# EAGLE design controller (EAGLE 8.1.0)
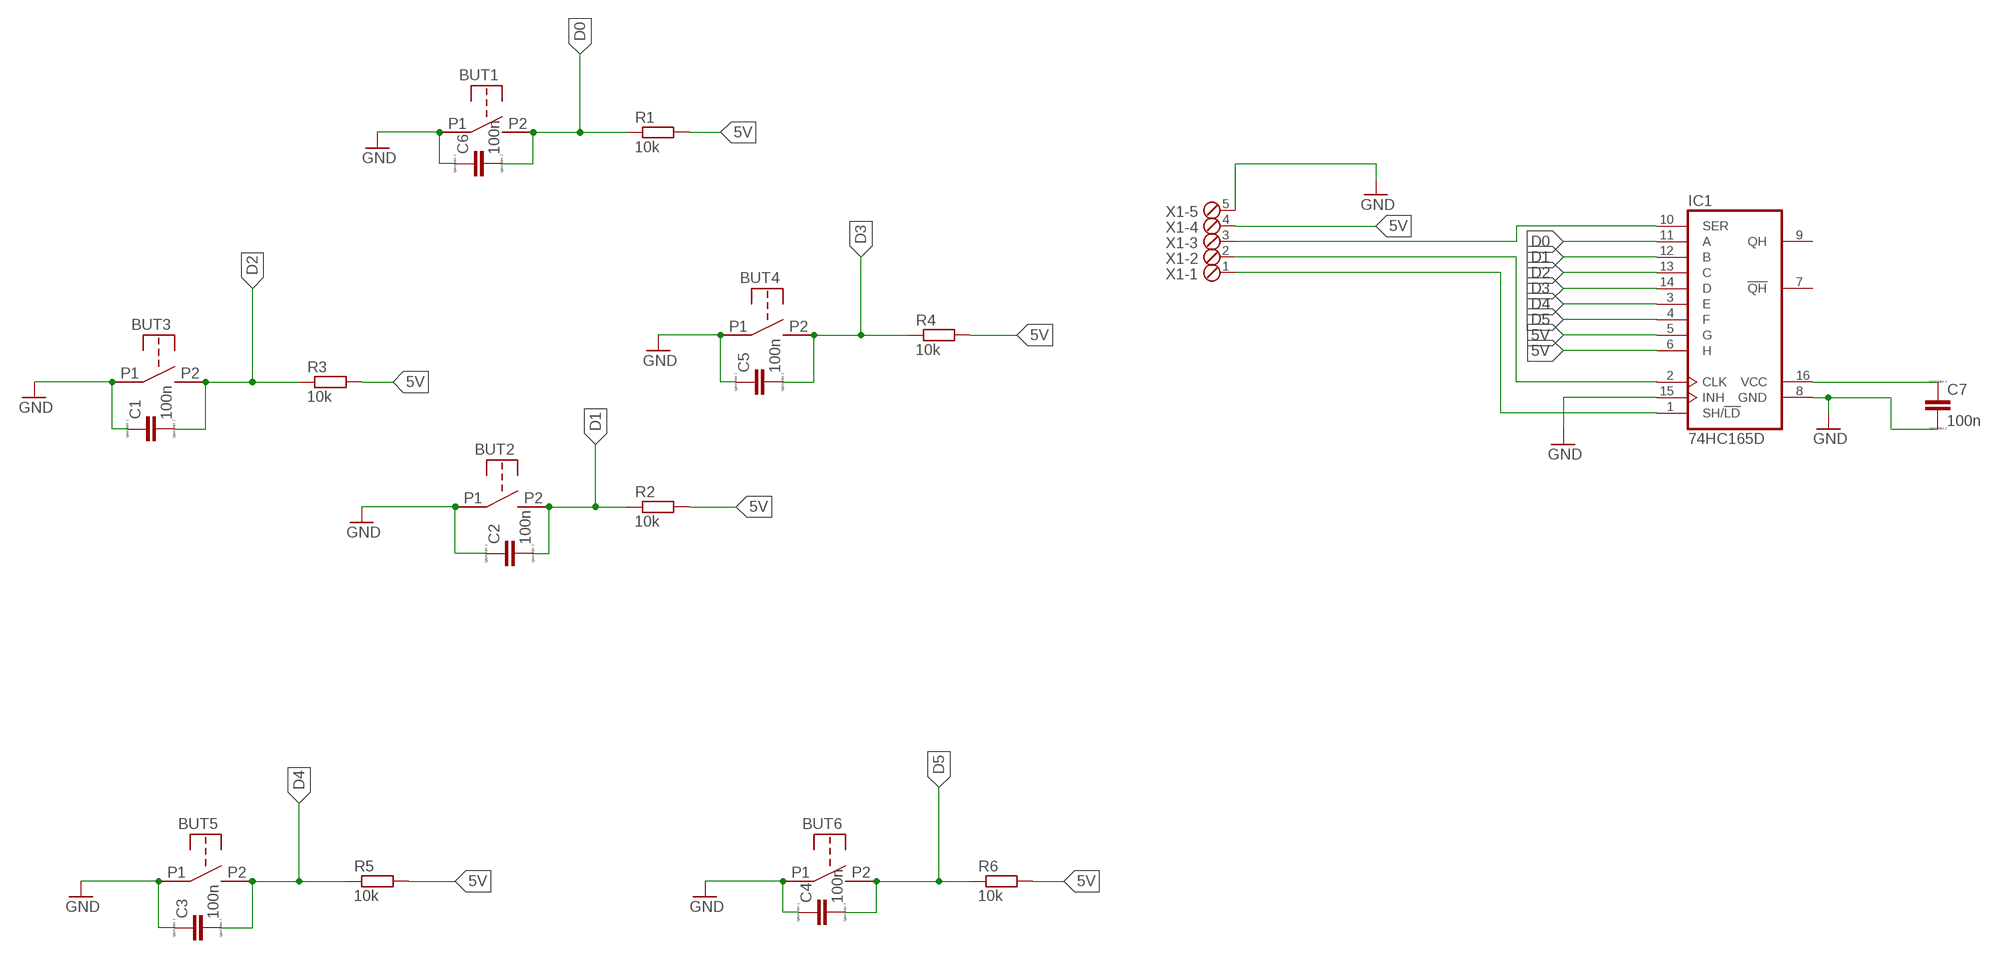
[diagram p0: schematic, sheet 1]

## Parts
BUT1  BUTTON_DEV  [BUTTON_PACK]
BUT2  BUTTON_DEV  [BUTTON_PACK]
BUT3  BUTTON_DEV  [BUTTON_PACK]
BUT4  BUTTON_DEV  [BUTTON_PACK]
BUT5  BUTTON_DEV  [BUTTON_PACK]
BUT6  BUTTON_DEV  [BUTTON_PACK]
C1  100n  C  [C0805]
C2  100n  C  [C0805]
C3  100n  C  [C0805]
C4  100n  C  [C0805]
C5  100n  C  [C0805]
C6  100n  C  [C0805]
C7  100n  C  [C0805]
IC1  74HC165D  [SO16]
R1  10k  R-EU_M3516  [M3516]
R2  10k  R-EU_M3516  [M3516]
R3  10k  R-EU_M3516  [M3516]
R4  10k  R-EU_M3516  [M3516]
R5  10k  R-EU_M3516  [M3516]
R6  10k  R-EU_M3516  [M3516]
X1  MPT5  [5POL254]

## Nets
5V: C7.1 IC1.5(G) IC1.6(H) IC1.16(VCC) R1.2 R2.2 R3.2 R4.2 R5.2 R6.2 X1.4
D0: BUT1.P2 BUT1.P2'(P2) C6.2 IC1.11(A) R1.1
D1: BUT2.P2 BUT2.P2'(P2) C2.2 IC1.12(B) R2.1
D2: BUT3.P2 BUT3.P2'(P2) C1.2 IC1.13(C) R3.1
D3: BUT4.P2 BUT4.P2'(P2) C5.2 IC1.14(D) R4.1
D4: BUT5.P2 BUT5.P2'(P2) C3.2 IC1.3(E) R5.1
D5: BUT6.P2 BUT6.P2'(P2) C4.2 IC1.4(F) R6.1
GND: BUT1.P1 BUT1.P1'(P1) BUT2.P1 BUT2.P1'(P1) BUT3.P1 BUT3.P1'(P1) BUT5.P1 BUT5.P1'(P1) BUT6.P1 BUT6.P1'(P1) C1.1 C2.1 C3.1 C4.1 C6.1 C7.2 IC1.8(GND) IC1.15(INH) X1.5
N3: BUT4.P1 BUT4.P1'(P1) C5.1 ; supply symbol labelled GND
N$1: IC1.1(SH/!LD) X1.1
N$2: IC1.2(CLK) X1.2
N$3: IC1.10(SER) X1.3
Unconnected: IC1.7(!QH) IC1.9(QH)

## Library data of the parts
BUT1-BUT6 = button:BUTTON_DEV
C1-C7 = eagle-ltspice:C: CAPACITOR, European symbol; SPICEMODEL: NONE; SPICEPREFIX: C
IC1 = 74xx-eu:74*165: 8-bit parallel load SHIFT REGISTER
R1-R6 = resistor:R-EU_: RESISTOR, European symbol
X1 = con-phoenix-254:MPT5: PHOENIX CONNECTOR; OC_FARNELL: unknown; OC_NEWARK: unknown

## Board
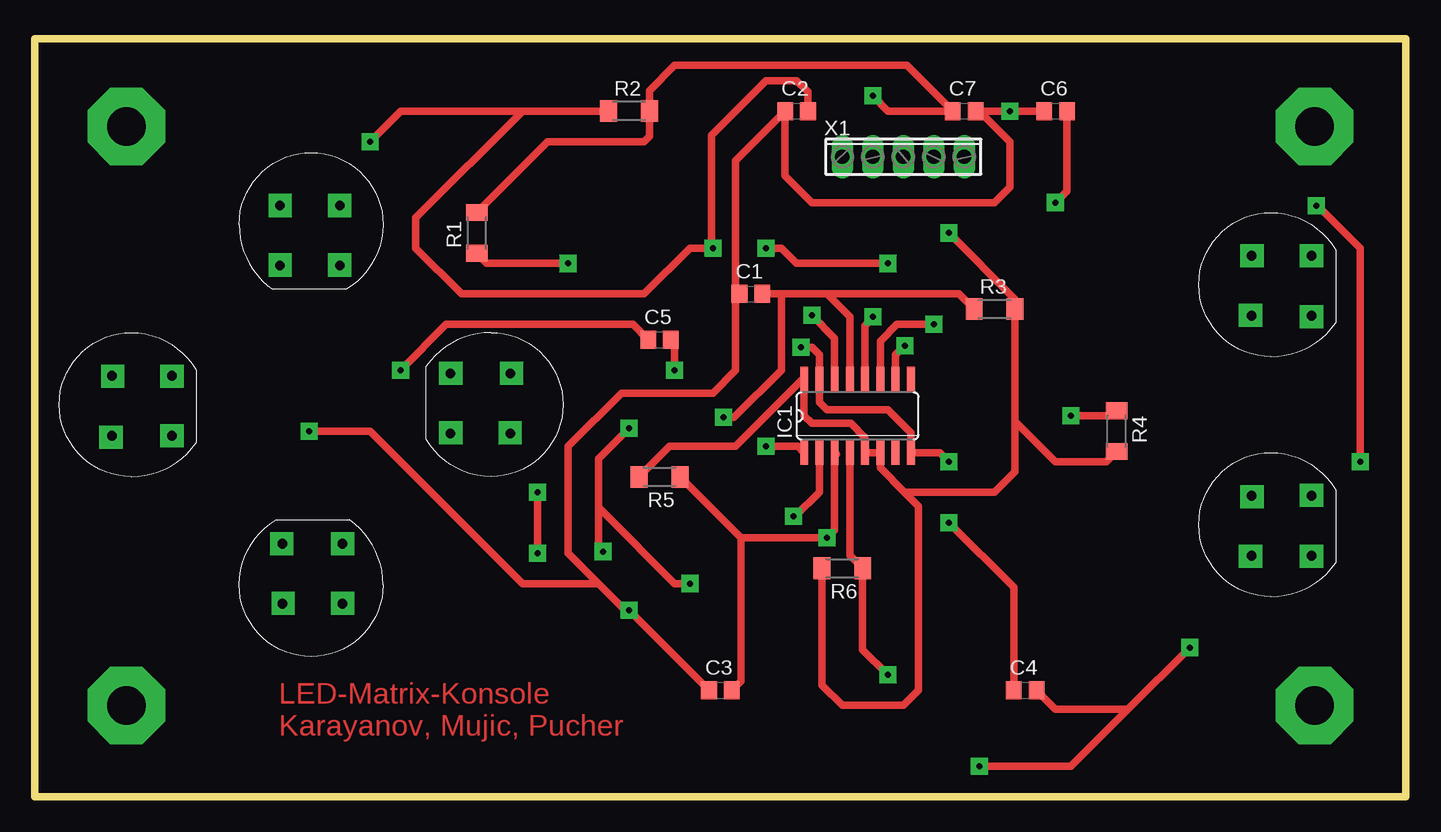
[diagram p1: board, top side]
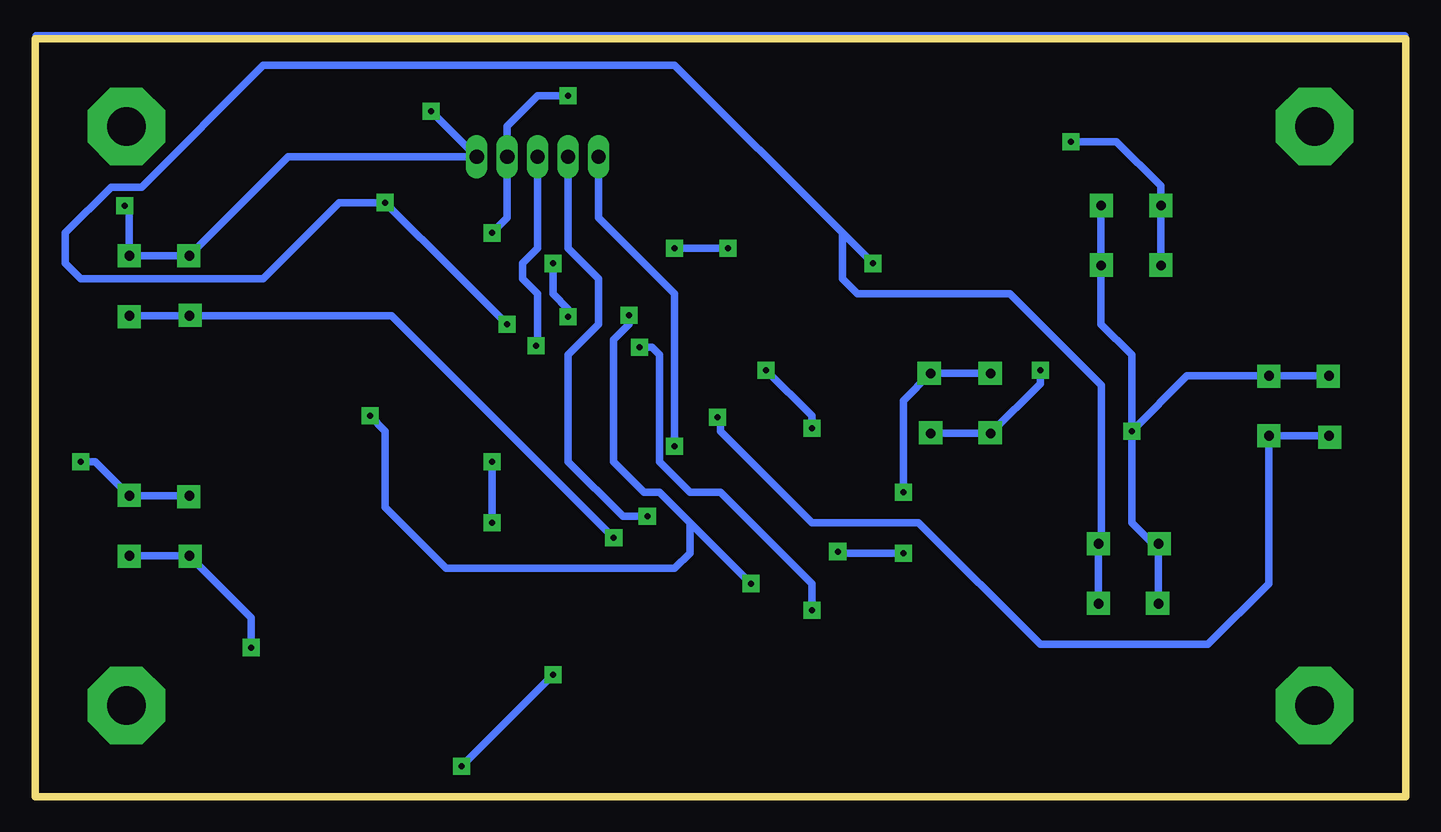
[diagram p2: board, bottom side, seen from below]

Size 114.28 x 63.17 mm. Coordinates in mm from the lower left corner, seen from the top.
Outline: 0,0 114.28,0 114.28,63.17 0,63.17 0,0
Copper layers (1*16): Top 0.035mm / dielectric 1.5mm / Bottom 0.035mm
Design rules "default": minimum track width 10mil, minimum drill 24mil, track to track 8mil, track to pad 8mil, pad to pad 8mil, via to via 8mil, smd to smd 8mil, copper to edge 40mil, drill to drill 8mil, minimum pad ring 10mil, minimum via ring 8mil, stop-mask expansion 4mil, vias tented up to drill 0mil, thermal gap 10mil

### Footprints (pad centres in the part's own frame; a part is rotated, then mirrored left to right if it is on the bottom)
BUTTON_PACK = drill 0.8 square: P1 -1.6,2.4; P1' 3.4,2.4; P2 -1.6,-2.6; P2' 3.4,-2.6
C0805 = smd 1.3 x 1.5: 1 -0.95,0; 2 0.95,0
SO16 = smd 0.66 x 2.032: 1 -4.445,-3.073; 2 -3.175,-3.073; 3 -1.905,-3.073; 4 -0.635,-3.073; 5 0.635,-3.073; 6 1.905,-3.073; 7 3.175,-3.073; 8 4.445,-3.073; 9 4.445,3.073; 10 3.175,3.073; 11 1.905,3.073; 12 0.635,3.073; 13 -0.635,3.073; 14 -1.905,3.073; 15 -3.175,3.073; 16 -4.445,3.073
M3516 = smd 1.4 x 1.8: 1 -1.7,0; 2 1.7,0
5POL254 = drill 1.2 long: 1 -5.08,0; 2 -2.54,0; 3 0,0; 4 2.54,0; 5 5.08,0

### Placement (x,y rotation side)
BUT1  23.03,17.69 90 top
BUT2  23.03,47.69 270 top
BUT3  8.03,32.69 0 top
BUT4  38.03,32.69 180 top
BUT5  103.03,42.69 0 top
BUT6  103.03,22.69 0 top
C1  59.69,41.91 0 top
C2  63.5,57.15 0 top
C3  57.15,8.89 0 top
C4  82.55,8.89 0 top
C5  52.07,38.1 0 top
C6  85.09,57.15 0 top
C7  77.47,57.15 0 top
IC1  68.58,31.75 0 top
R1  36.83,46.99 90 top
R2  49.53,57.15 0 top
R3  80.01,40.64 0 top
R4  90.17,30.48 270 top
R5  52.07,26.67 180 top
R6  67.31,19.05 180 top
X1  72.39,53.34 0 top

### Tracks (layer width: path | path; a pad name or v marks a point on that pad's centre or on a via)
5V  (via drill 0.5 pad 1.42)
  Top 0.61: v69.85,58.42 71.12,57.15 C7.1 72.71,60.96 53.34,60.96 51.23,58.85 R2.2 51.23,55.04 50.8,54.61 42.75,54.61 R1.2 | 81.71,31.32 R3.2 81.71,41.48 v76.2,46.99 | 81.71,31.32 85.09,27.94 89.33,27.94 R4.2 | 81.71,31.32 81.71,27.1 80.01,25.4 72.49,25.4 | IC1.6 70.48,28.57 | R5.2 52.91,29.21 58.42,29.21 64.03,34.82 IC1.16 64.14,31.75 64.77,31.11 68.05,31.11 69.22,29.95 IC1.5 IC1.6 | R6.2 65.61,9.32 67.31,7.62 72.39,7.62 73.66,8.89 73.66,24.23 72.49,25.4 | 72.49,25.4 70.48,27.41 IC1.6
  Bottom 0.61: v69.85,58.42 72.39,58.42 74.93,55.88 X1.4 74.93,48.26 v76.2,46.99
D0  (via drill 0.5 pad 1.42)
  Top 0.61: v74.93,39.37 71.88,39.37 70.48,37.97 IC1.11 | v44.45,44.45 37.67,44.45 R1.1 | v85.09,49.53 86.04,50.48 C6.2
  Bottom 0.61: v74.93,39.37 79.1,43.54 79.12,43.54 85.09,49.51 | 85.09,49.51 88.92,49.51 95.25,43.18 110.49,43.18 111.76,44.45 111.76,46.99 107.95,50.8 105.41,50.8 95.25,60.96 60.96,60.96 46.99,46.99 | v44.45,44.45 46.99,46.99 | BUT1.P2 BUT1.P2' 25.4,21.32 25.4,34.29 33.02,41.91 45.72,41.91 46.99,43.18 46.99,46.99 | v85.09,49.53 85.09,49.51
D1  (via drill 0.5 pad 1.42)
  Top 0.61: 40.64,57.15 R2.1 | v71.12,44.45 63.5,44.45 62.23,45.72 v60.96,45.72 | C2.2 64.45,58.74 63.5,59.69 60.96,59.69 56.39,55.12 56.39,45.85 v56.52,45.72 54.61,45.72 50.8,41.91 35.56,41.91 31.75,45.72 31.75,48.26 40.64,57.15 | v69.85,40.01 69.85,39.88 69.22,39.24 IC1.12 | v27.94,54.61 30.48,57.15 40.64,57.15
  Bottom 0.61: BUT2.P2' BUT2.P2 20.43,50.91 24.13,54.61 v27.94,54.61 | v60.96,45.72 v56.52,45.72 | v71.12,44.45 71.12,41.91 69.85,40.64 v69.85,40.01
D2  (via drill 0.5 pad 1.42)
  Top 0.61: 62.23,41.91 66.04,41.91 | 62.23,41.91 C1.2 | 62.23,41.91 62.23,35.56 58.29,31.62 v57.4,31.62 | IC1.13 67.94,40.01 66.04,41.91 | R3.1 77.04,41.91 66.04,41.91
  Bottom 0.61: BUT3.P2 BUT3.P2' 11.43,17.78 16.51,12.7 30.48,12.7 40.64,22.86 49.53,22.86 57.15,30.48 57.15,31.37 v57.4,31.62
D3  (via drill 0.5 pad 1.42)
  Top 0.61: IC1.14 66.67,38.23 v64.77,40.13 | v54.61,17.78 53.34,17.78 47.37,23.75 46.99,24.13 | v53.34,35.56 53.34,37.78 C5.2 | v86.36,31.75 89.74,31.75 R4.1 | v41.91,20.32 v41.91,25.4 | 46.99,24.13 46.99,28.19 v49.53,30.73 | v47.37,20.45 46.99,20.83 46.99,24.13
  Bottom 0.61: BUT4.P2' BUT4.P2 41.91,33.01 v41.91,25.4 | 59.69,22.86 v54.61,17.78 | v86.36,31.75 85.09,30.48 85.09,24.13 80.01,19.05 60.96,19.05 59.69,20.32 59.69,22.86 | 59.69,22.86 62.23,25.4 63.5,25.4 66.04,27.94 66.04,38.1 64.77,39.37 v64.77,40.13 | v49.53,30.73 49.53,31.75 v53.34,35.56 | v41.91,20.32 47.24,20.32 v47.37,20.45
D4  (via drill 0.5 pad 1.42)
  Top 0.61: 66.8,28.55 IC1.3 66.67,22.23 v66.04,21.59 58.85,21.59 | 58.85,21.59 R5.1 | C3.2 58.85,9.64 58.85,20.32 | 58.85,20.32 58.85,20.75 | 58.85,20.32 58.85,21.59
  Bottom 0.61: BUT5.P2' BUT5.P2 84.54,40.09 v66.04,21.59
D5  (via drill 0.5 pad 1.42)
  Top 0.61: v71.12,10.16 69.01,12.27 R6.1 67.94,20.11 IC1.4 | C4.2 85.09,7.3 91.12,7.3 | 91.12,7.3 v96.27,12.45 | 91.12,7.3 86.36,2.54 v78.74,2.54
  Bottom 0.61: BUT6.P2' BUT6.P2 96.27,14.93 v96.27,12.45 | v71.12,10.16 v78.74,2.54
GND  (via drill 0.5 pad 1.42)
  Top 0.61: 78.74,57.15 C7.2 | v81.28,57.15 78.74,57.15 | v81.28,57.15 C6.1 | v110.49,27.94 110.49,45.72 106.93,49.28 v106.81,49.28 | v22.86,30.48 27.94,30.48 40.64,17.78 46.99,17.78 | C4.1 81.6,17.46 v76.2,22.86 | C3.1 v49.53,15.56 49.21,15.56 46.99,17.78 | 78.74,57.47 C7.2 | 78.74,57.15 81.28,54.61 81.28,50.8 80.01,49.53 64.77,49.53 62.55,51.75 C2.1 58.42,53.02 58.42,42.23 C1.1 58.42,41.59 58.42,35.56 56.52,33.66 48.9,33.66 44.45,29.21 44.45,20.32 46.99,17.78 | v63.88,37.47 64.77,37.47 65.41,36.83 IC1.15 65.41,32.89 66.04,32.26 71.12,32.26 73.03,30.35 IC1.8 75.46,28.68 v76.2,27.94 | C7.2 v81.28,57.15
  Bottom 0.61: BUT5.P1' BUT5.P1 93.18,53.34 X1.5 v81.28,57.15 | BUT2.P1 BUT2.P1' 25.43,39.4 22.86,36.83 v22.86,30.48 | v110.49,27.94 109.28,27.94 BUT6.P1' BUT6.P1 | BUT1.P1 BUT1.P1' 21.09,21.09 22.86,22.86 v22.86,30.48 | BUT3.P1 BUT3.P1' 18.25,35.09 v22.86,30.48 | v76.2,27.94 v76.2,22.86 | v49.53,15.56 49.53,17.78 57.15,25.4 59.69,25.4 62.23,27.94 62.23,36.83 62.87,37.47 v63.88,37.47 | BUT5.P1' | BUT5.P1' 106.43,48.9 v106.81,49.28
N3  (via drill 0.5 pad 1.42)
  Top 0.61: C5.1 49.85,39.37 34.29,39.37 v30.48,35.56
  Bottom 0.61: BUT4.P1 BUT4.P1' 30.48,34.44 v30.48,35.56
N$1  (via drill 0.5 pad 1.42)
  Top 0.61: v60.96,29.21 63.6,29.21 IC1.1
  Bottom 0.61: X1.1 67.31,48.26 60.96,41.91 v60.96,29.21
N$2  (via drill 0.5 pad 1.42)
  Top 0.61: IC1.2 65.41,25.4 63.37,23.37 v63.25,23.37
  Bottom 0.61: X1.2 69.85,45.72 67.31,43.18 67.31,39.37 69.85,36.83 69.85,27.94 65.28,23.37 v63.25,23.37
N$3  (via drill 0.5 pad 1.42)
  Top 0.305: 71.75,36.2 IC1.10
  Top 0.61: IC1.10 71.75,36.83 v72.52,37.59
  Bottom 0.61: v72.52,37.59 72.39,37.72 72.39,41.91 73.66,43.18 73.66,44.45 72.39,45.72 X1.3
N$4  (via drill 3.2 pad 6.45)
  other vias: 7.62,55.88
N$5  (via drill 3.2 pad 6.45)
  other vias: 106.68,55.88
N$6  (via drill 3.2 pad 6.45)
  other vias: 7.62,7.62
N$7  (via drill 3.2 pad 6.45)
  other vias: 106.68,7.62
N$8
  Bottom 0.406: 0,63.5 114.3,63.5 114.3,0 0,0 0,63.5
N$9  (via drill 0.5 pad 1.93)
  other vias: 101.47,45.09
N$10  (via drill 0.5 pad 1.93)
  other vias: 106.43,45.09
N$11  (via drill 0.5 pad 1.93)
  other vias: 106.43,40.01
N$12  (via drill 0.5 pad 1.93)
  other vias: 101.35,40.13
N$13  (via drill 0.5 pad 1.93)
  other vias: 101.47,25.02
N$14  (via drill 0.5 pad 1.93)
  other vias: 106.43,25.15
N$15  (via drill 0.5 pad 1.93)
  other vias: 106.43,20.07
N$16  (via drill 0.5 pad 1.93)
  other vias: 101.35,20.07
N$17  (via drill 0.5 pad 1.93)
  other vias: 25.65,21.08
N$18  (via drill 0.5 pad 1.93)
  other vias: 25.65,16.13
N$19  (via drill 0.5 pad 1.93)
  other vias: 20.7,16.13
N$20  (via drill 0.5 pad 1.93)
  other vias: 20.57,21.08
N$21  (via drill 0.5 pad 1.93)
  other vias: 11.43,30.1
N$22  (via drill 0.5 pad 1.93)
  other vias: 6.35,29.97
N$23  (via drill 0.5 pad 1.93)
  other vias: 6.48,35.05
N$24  (via drill 0.5 pad 1.93)
  other vias: 11.43,35.05
N$25  (via drill 0.5 pad 1.93)
  other vias: 20.45,44.32
N$26  (via drill 0.5 pad 1.93)
  other vias: 25.4,44.32
N$27  (via drill 0.5 pad 1.93)
  other vias: 25.4,49.28
N$28  (via drill 0.5 pad 1.93)
  other vias: 20.45,49.28
N$29  (via drill 0.5 pad 1.93)
  other vias: 34.67,35.31
N$30  (via drill 0.5 pad 1.93)
  other vias: 39.75,35.31
N$31  (via drill 0.5 pad 1.93)
  other vias: 39.62,30.35
N$32  (via drill 0.5 pad 1.93)
  other vias: 34.67,30.35

### Text on the board
Top: LED-Matrix-Konsole / Karayanov, Mujic, Pucher